# Altium schematic sheet Приемник.SchDoc
size A1
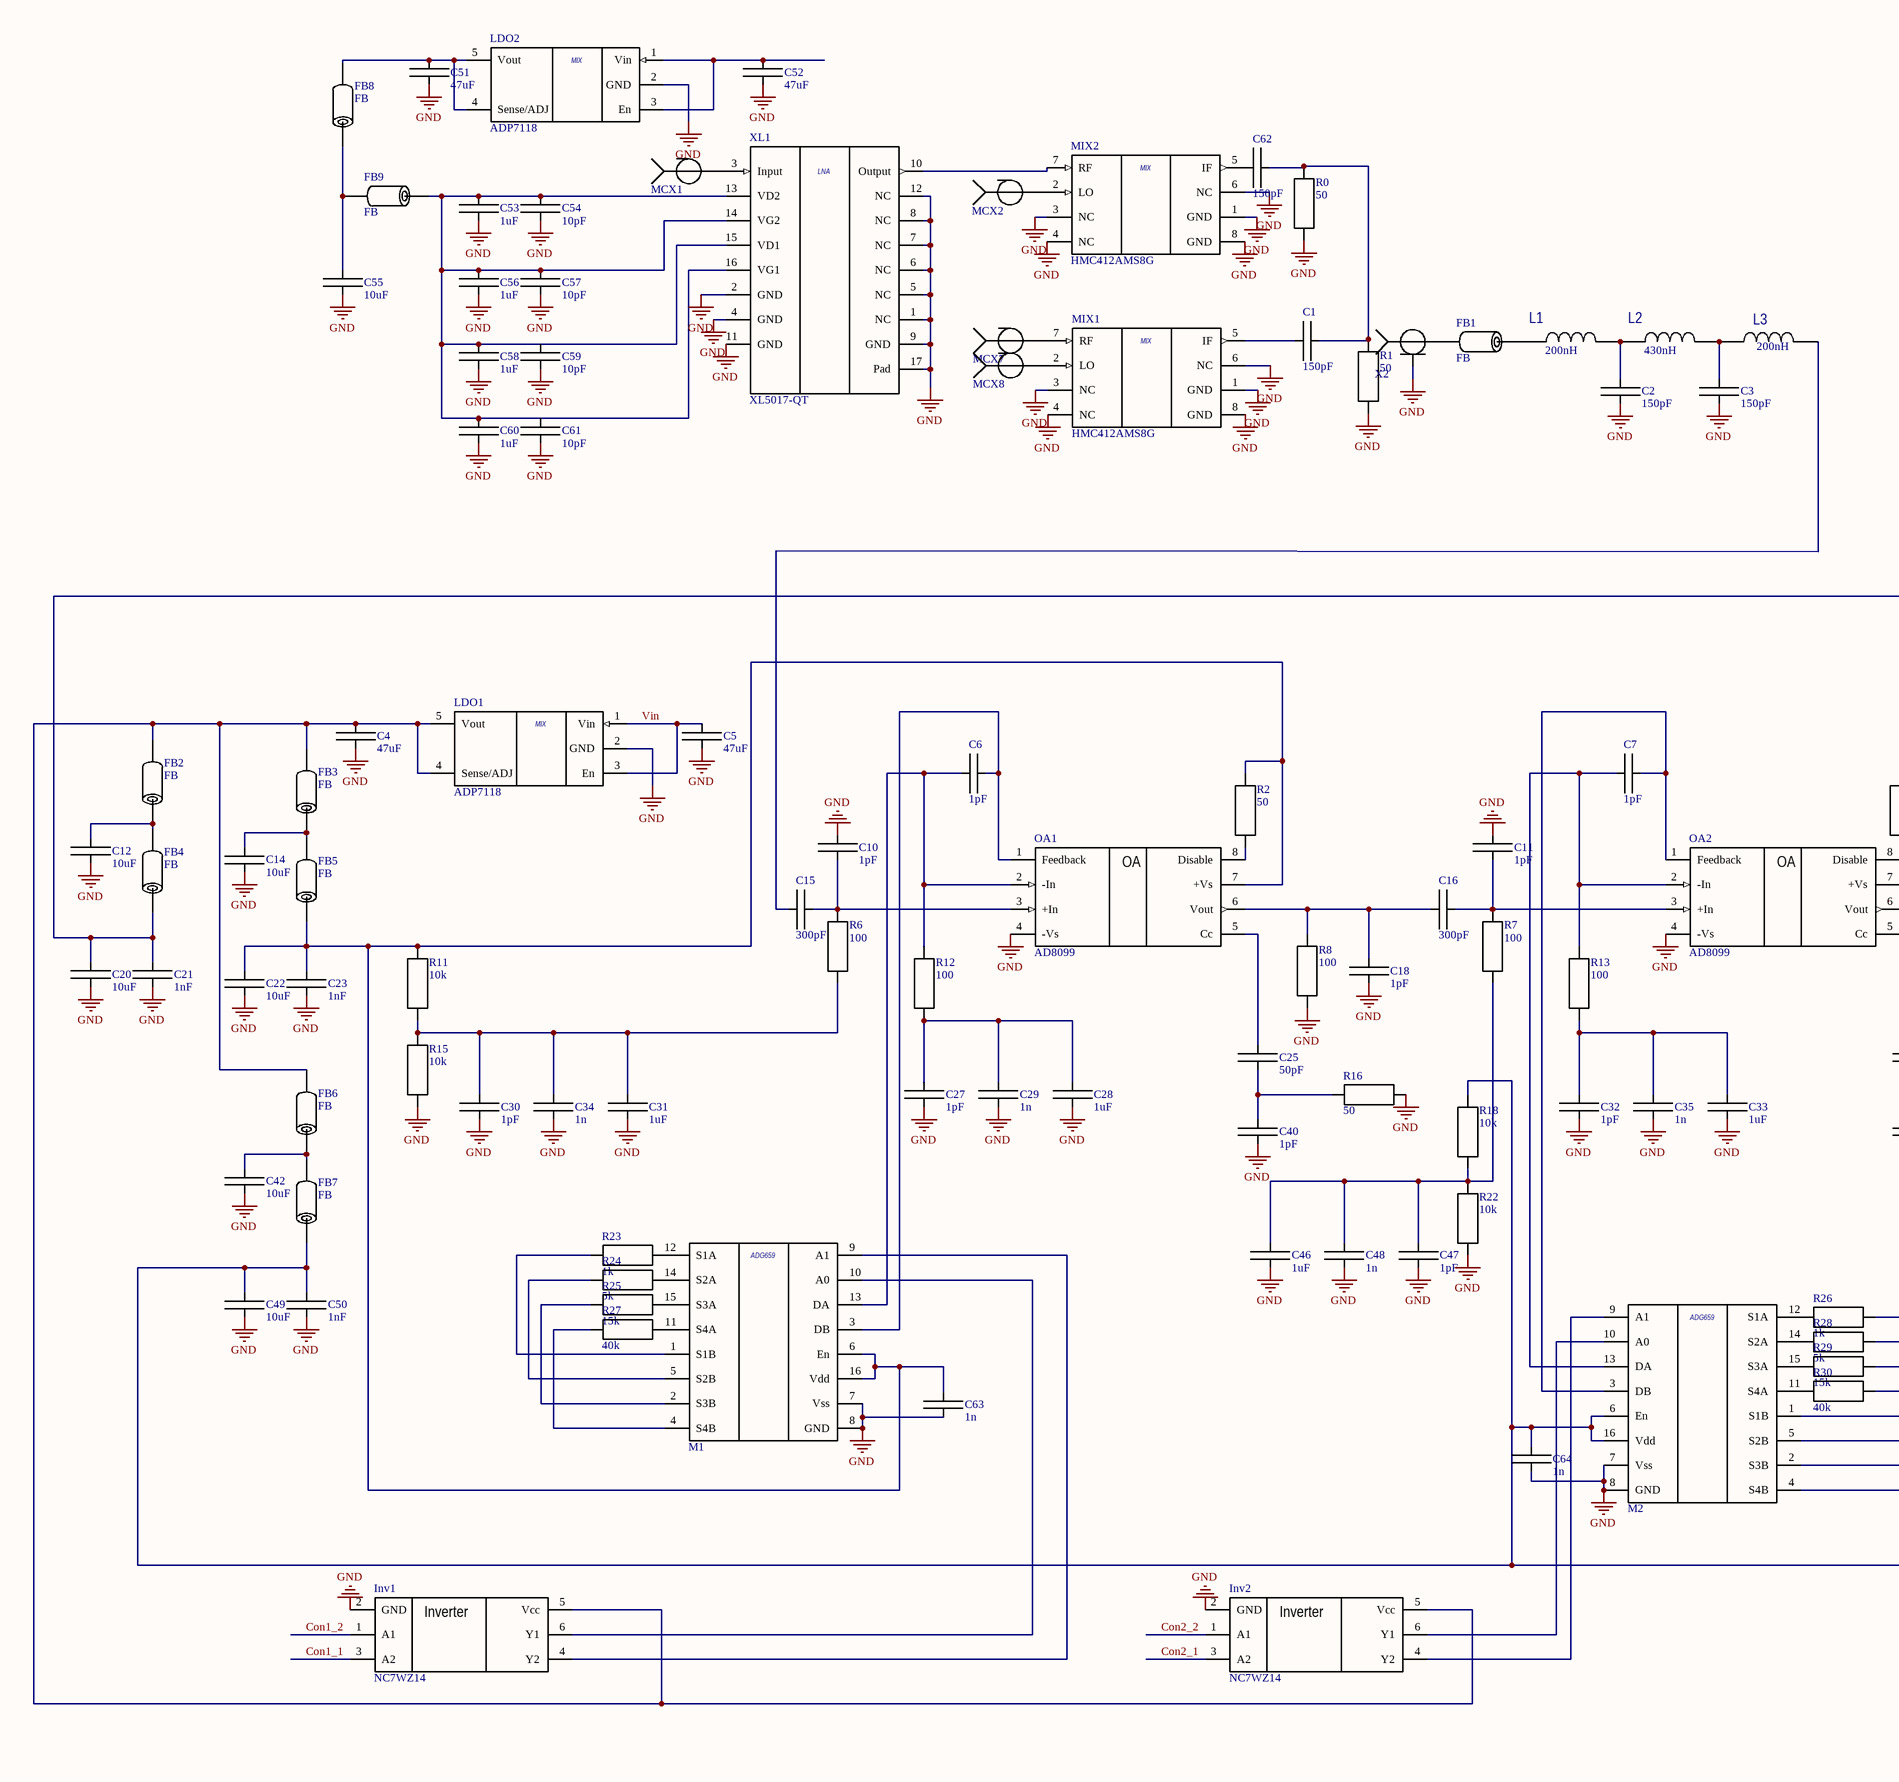
[diagram p0: Приемник.SchDoc, left]
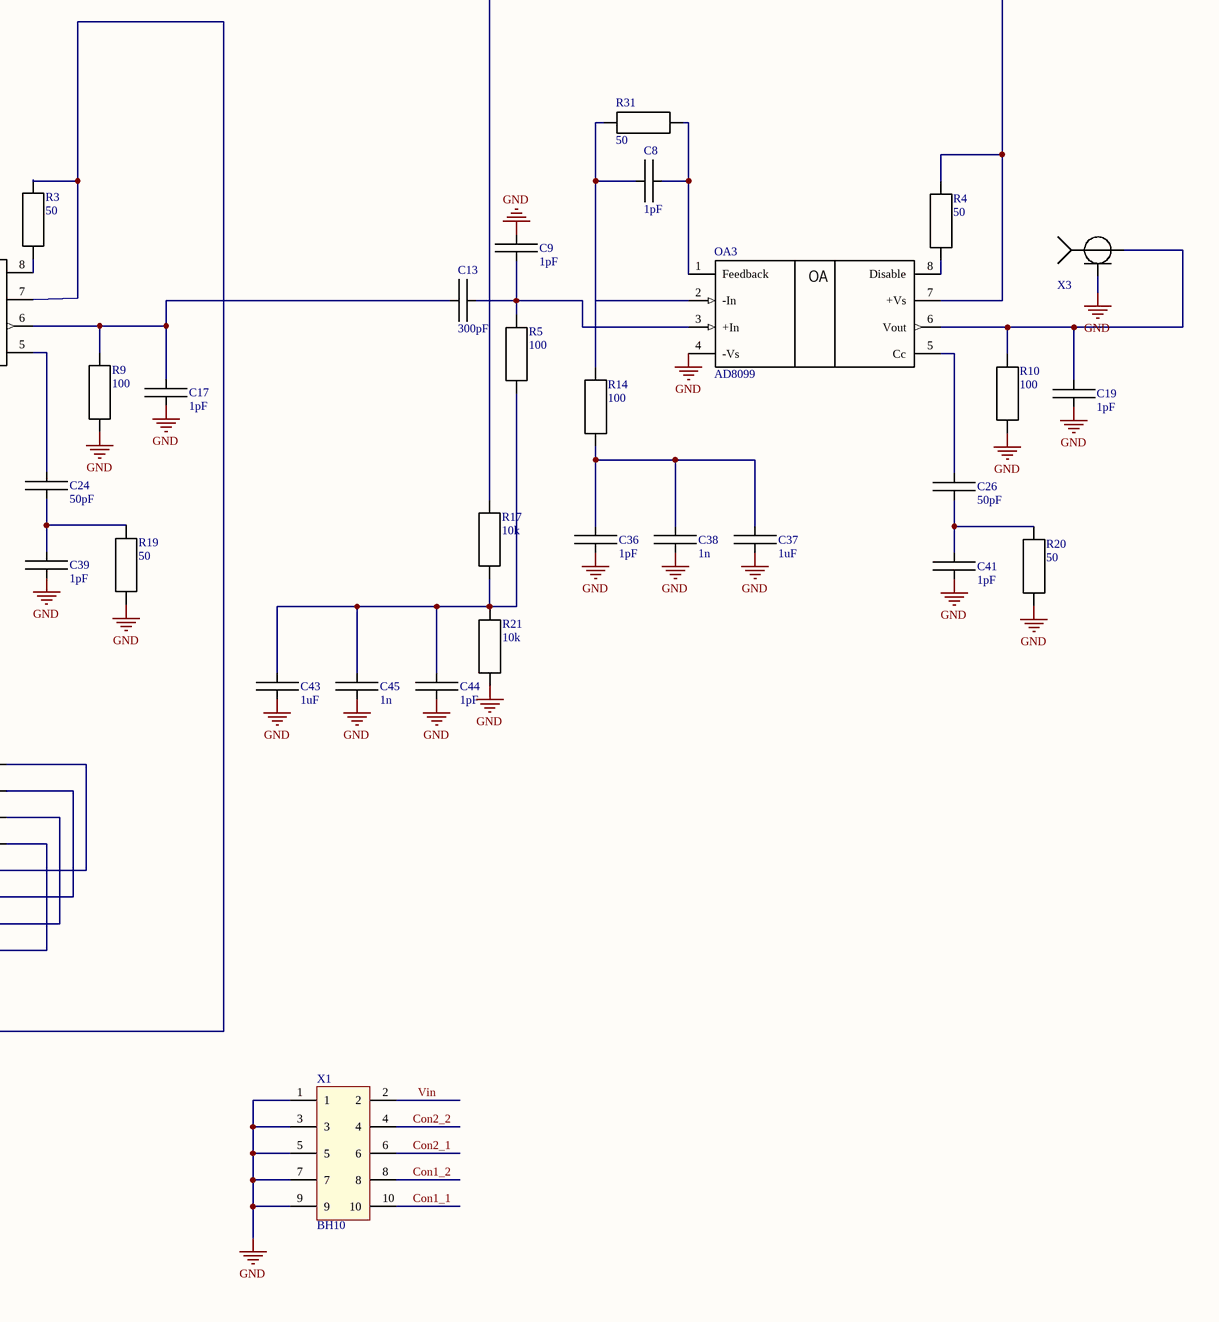
[diagram p1: Приемник.SchDoc, right]

## Parts
C1  150pF  [SMD0402]
C2  150pF  [SMD0402]
C3  150pF  [SMD0402]
C4  47uF  [B3528-21]
C5  47uF  [B3528-21]
C6  1pF  [SMD0402]
C7  1pF  [SMD0402]
C8  1pF  [SMD0402]
C9  1pF  [SMD0402]
C10  1pF  [SMD0402]
C11  1pF  [SMD0402]
C12  10uF  [SMD0603]
C13  300pF  [SMD0402]
C14  10uF  [SMD0603]
C15  300pF  [SMD0402]
C16  300pF  [SMD0402]
C17  1pF  [SMD0402]
C18  1pF  [SMD0402]
C19  1pF  [SMD0402]
C20  10uF  [SMD0603]
C21  1nF  [SMD0402]
C22  10uF  [SMD0603]
C23  1nF  [SMD0402]
C24  50pF  [SMD0402]
C25  50pF  [SMD0402]
C26  50pF  [SMD0402]
C27  1pF  [SMD0402]
C28  1uF  [SMD0603]
C29  1n  [SMD0402]
C30  1pF  [SMD0402]
C31  1uF  [SMD0603]
C32  1pF  [SMD0402]
C33  1uF  [SMD0603]
C34  1n  [SMD0402]
C35  1n  [SMD0402]
C36  1pF  [SMD0402]
C37  1uF  [SMD0603]
C38  1n  [SMD0402]
C39  1pF  [SMD0402]
C40  1pF  [SMD0402]
C41  1pF  [SMD0402]
C42  10uF  [SMD0603]
C43  1uF  [SMD0603]
C44  1pF  [SMD0402]
C45  1n  [SMD0402]
C46  1uF  [SMD0603]
C47  1pF  [SMD0402]
C48  1n  [SMD0402]
C49  10uF  [SMD0603]
C50  1nF  [SMD0402]
C51  47uF  [B3528-21]
C52  47uF  [B3528-21]
C53  1uF  [SMD0603]
C54  10pF  [SMD0402]
C55  10uF  [SMD0603]
C56  1uF  [SMD0603]
C57  10pF  [SMD0402]
C58  1uF  [SMD0603]
C59  10pF  [SMD0402]
C60  1uF  [SMD0603]
C61  10pF  [SMD0402]
C62  150pF  [SMD0402]
C63  1n  [SMD0402]
C64  1n  [SMD0402]
FB1  FB  [FV1206]
FB2  FB  [FV1206]
FB3  FB  [FV1206]
FB4  FB  [FV1206]
FB5  FB  [FV1206]
FB6  FB  [FV1206]
FB7  FB  [FV1206]
FB8  FB  [FV1206]
FB9  FB  [FV1206]
Inv1  NC7WZ14  [SC70]
Inv2  NC7WZ14  [SC70]
L1  200nH  [SMD0603]
L2  430nH  [SMD0603]
L3  200nH  [SMD0603]
LDO1  ADP7118  [TSOT5]
LDO2  ADP7118  [TSOT5]
M1  ADG658_659  [TSSOP16]  (value not drawn)
M2  ADG658_659  [TSSOP16]  (value not drawn)
MCX1  MCX  [MCX]  (value not drawn)
MCX2  MCX  [MCX]  (value not drawn)
MCX7  MCX  [MCX]  (value not drawn)
MCX8  MCX  [MCX]  (value not drawn)
MIX1  HMC412AMS8G  [HMC412AMS8G]
MIX2  HMC412AMS8G  [HMC412AMS8G]
OA1  AD8099  [SOIC_8_EP]
OA2  AD8099  [SOIC_8_EP]
OA3  AD8099  [SOIC_8_EP]
R0  50  [SMD0603]
R1  50  [SMD0603]
R2  50  [SMD0603]
R3  50  [SMD0603]
R4  50  [SMD0603]
R5  100  [SMD0603]
R6  100  [SMD0603]
R7  100  [SMD0603]
R8  100  [SMD0603]
R9  100  [SMD0603]
R10  100  [SMD0603]
R11  10k  [SMD0603]
R12  100  [SMD0603]
R13  100  [SMD0603]
R14  100  [SMD0603]
R15  10k  [SMD0603]
R16  50  [SMD0603]
R17  10k  [SMD0603]
R18  10k  [SMD0603]
R19  50  [SMD0603]
R20  50  [SMD0603]
R21  10k  [SMD0603]
R22  10k  [SMD0603]
R23  1k  [SMD0603]
R24  5k  [SMD0603]
R25  15k  [SMD0603]
R26  1k  [SMD0603]
R27  40k  [SMD0603]
R28  5k  [SMD0603]
R29  15k  [SMD0603]
R30  40k  [SMD0603]
R31  50  [SMD0603]
X1  BH10  [BH10]
X2  MCX 1085221-1  [MCX]  (value not drawn)
X3  MCX 1085221-1  [MCX]  (value not drawn)
XL1  XL5017-QT  [XL5017-QT]

## Nets
GND: C2.1 C3.1 C4.1 C5.1 C9.1 C10.2 C11.1 C12.1 C14.1 C17.1 C18.2 C19.1 C20.1 C21.2 C22.1 C23.2 C27.1 C28.1 C29.1 C30.1 C31.1 C32.1 C33.1 C34.1 C35.1 C36.1 C37.1 C38.1 C39.1 C40.2 C41.1 C42.1 C43.1 C44.1 C45.1 C46.1 C47.1 C48.1 C49.1 C50.2 C51.1 C52.1 C53.1 C54.1 C55.1 C56.1 C57.1 C58.1 C59.1 C60.1 C61.1 C63.1 C64.1 Inv1.2(GND) Inv2.2(GND) LDO1.2(GND) LDO2.2(GND) M1.7(Vss) M1.8(GND) M2.7(Vss) M2.8(GND) MIX1.1(GND) MIX1.3(NC) MIX1.4(NC) MIX1.6(NC) MIX1.8(GND) MIX2.1(GND) MIX2.3(NC) MIX2.4(NC) MIX2.6(NC) MIX2.8(GND) OA1.4(-Vs) OA2.4(-Vs) OA3.4(-Vs) R0.1 R1.1 R8.2 R9.2 R10.2 R15.1 R16.2 R19.2 R20.2 R21.1 R22.1 X1.1 X1.3 X1.5 X1.7 X1.9 X2.2 X3.2 XL1.1(NC) XL1.2(GND) XL1.4(GND) XL1.5(NC) XL1.6(NC) XL1.7(NC) XL1.8(NC) XL1.9(GND) XL1.11(GND) XL1.12(NC) XL1.17(Pad)
Con1_1: Inv1.3(A2) X1.10
Con1_2: Inv1.1(A1) X1.8
Con2_1: Inv2.3(A2) X1.6
Con2_2: Inv2.1(A1) X1.4
Vin: C5.2 LDO1.1(Vin) LDO1.3(En) X1.2
NetC1_1: C1.1 C62.2 R0.2 R1.2
NetC1_2: C1.2 MIX1.5(IF)
NetC2_2: C2.2 L1.2 L2.1
NetC3_2: C3.2 L2.2 L3.1
NetC4_2: C4.2 FB2.2 FB3.2 FB6.2 Inv1.5(Vcc) Inv2.5(Vcc) LDO1.4(Sense/ADJ) LDO1.5(Vout)
NetC6_1: C6.1 M1.3(DB) OA1.1(Feedback)
NetC6_2: C6.2 M1.13(DA) OA1.2(-In) R12.2
NetC7_1: C7.1 M2.13(DA) OA2.2(-In) R13.2
NetC7_2: C7.2 M2.3(DB) OA2.1(Feedback)
NetC8_1: C8.1 OA3.2(-In) R14.2 R31.1
NetC8_2: C8.2 OA3.1(Feedback) R31.2
NetC9_2: C9.2 C13.2 OA3.3(+In) R5.2
NetC10_1: C10.1 C15.1 OA1.3(+In) R6.2
NetC11_2: C11.2 C16.2 OA2.3(+In) R7.2
NetC12_2: C12.2 FB2.1 FB4.2
NetC13_1: C13.1 C17.2 OA2.6(Vout) R9.1
NetC14_2: C14.2 FB3.1 FB5.2
NetC15_2: C15.2 L3.2
NetC16_1: C16.1 C18.1 OA1.6(Vout) R8.1
NetC19_2: C19.2 OA3.6(Vout) R10.1 X3.1
NetC20_2: C20.2 C21.1 FB4.1 OA3.7(+Vs) R4.1 R17.2
NetC22_2: C22.2 C23.1 C63.2 FB5.1 M1.6(En) M1.16(Vdd) OA1.7(+Vs) R2.1 R11.2
NetC24_1: C24.1 C39.2 R19.1
NetC24_2: C24.2 OA2.5(Cc)
NetC25_1: C25.1 OA1.5(Cc)
NetC25_2: C25.2 C40.1 R16.1
NetC26_1: C26.1 C41.2 R20.1
NetC26_2: C26.2 OA3.5(Cc)
NetC27_2: C27.2 C28.2 C29.2 R12.1
NetC30_2: C30.2 C31.2 C34.2 R6.1 R11.1 R15.2
NetC32_2: C32.2 C33.2 C35.2 R13.1
NetC36_2: C36.2 C37.2 C38.2 R14.1
NetC42_2: C42.2 FB6.1 FB7.2
NetC43_2: C43.2 C44.2 C45.2 R5.1 R17.1 R21.2
NetC46_2: C46.2 C47.2 C48.2 R7.1 R18.1 R22.2
NetC49_2: C49.2 C50.1 C64.2 FB7.1 M2.6(En) M2.16(Vdd) OA2.7(+Vs) R3.1 R18.2
NetC51_2: C51.2 FB8.2 LDO2.4(Sense/ADJ) LDO2.5(Vout)
NetC52_2: C52.2 LDO2.1(Vin) LDO2.3(En)
NetC53_2: C53.2 C54.2 C56.2 C57.2 C58.2 C59.2 C60.2 C61.2 FB9.1 XL1.13(VD2) XL1.14(VG2) XL1.15(VD1) XL1.16(VG1)
NetC55_2: C55.2 FB8.1 FB9.2
NetC62_1: C62.1 MIX2.5(IF)
NetFB1_1: FB1.1 L1.1
NetFB1_2: FB1.2 X2.1
NetInv1_4: Inv1.4(Y2) M1.9(A1)
NetInv1_6: Inv1.6(Y1) M1.10(A0)
NetInv2_4: Inv2.4(Y2) M2.9(A1)
NetInv2_6: Inv2.6(Y1) M2.10(A0)
NetM1_1: M1.1(S1B) R23.2
NetM1_2: M1.2(S3B) R25.2
NetM1_4: M1.4(S4B) R27.2
NetM1_5: M1.5(S2B) R24.2
NetM1_11: M1.11(S4A) R27.1
NetM1_12: M1.12(S1A) R23.1
NetM1_14: M1.14(S2A) R24.1
NetM1_15: M1.15(S3A) R25.1
NetM2_1: M2.1(S1B) R26.2
NetM2_2: M2.2(S3B) R29.2
NetM2_4: M2.4(S4B) R30.2
NetM2_5: M2.5(S2B) R28.2
NetM2_11: M2.11(S4A) R30.1
NetM2_12: M2.12(S1A) R26.1
NetM2_14: M2.14(S2A) R28.1
NetM2_15: M2.15(S3A) R29.1
NetMCX1_1: MCX1.1 XL1.3(Input)
NetMCX2_1: MCX2.1 MIX2.2(LO)
NetMCX7_1: MCX7.1 MIX1.7(RF)
NetMCX8_1: MCX8.1 MIX1.2(LO)
NetMIX2_7: MIX2.7(RF) XL1.10(Output)
NetOA1_8: OA1.8(Disable) R2.2
NetOA2_8: OA2.8(Disable) R3.2
NetOA3_8: OA3.8(Disable) R4.2

Not connected (* = marked no-connect by the designer): MCX1 2(GND); MCX2 2(GND); MCX7 2(GND); MCX8 2(GND)

## Notes on the sheet
- Title
- Size:
- Date:
- File:
- A1
- Number:
- Time:
- Revision:
- Sheet
- of
- (in symbol AD8099) OA
- (in symbol ADG658_659) ADG659
- (in symbol ADP7118) MIX
- (in symbol HMC412AMS8G) MIX
- (in symbol NC7WZ14) Inverter
- (in symbol XL5017-QT) LNA

## Library data of the parts
C1-C3 C6-C11 C13 C15-C19 C21 C23-C27 C29 C30 C32 C34-C36 C38-C41 C44 C45 C47 C48 C50 C54 C57 C59 C61-C64 = CAP0402
C4 C5 C51 C52 = CAPT10V4.7-100uF
C12 C14 C20 C22 C28 C31 C33 C37 C42 C43 C46 C49 C53 C55 C56 C58 C60 = CAP0603
L1-L3 = IND0603
R0-R31 = RES0402